# Altium schematic sheet Input.SchDoc
size A2; SheetNumber: 5; SheetTotal: 6
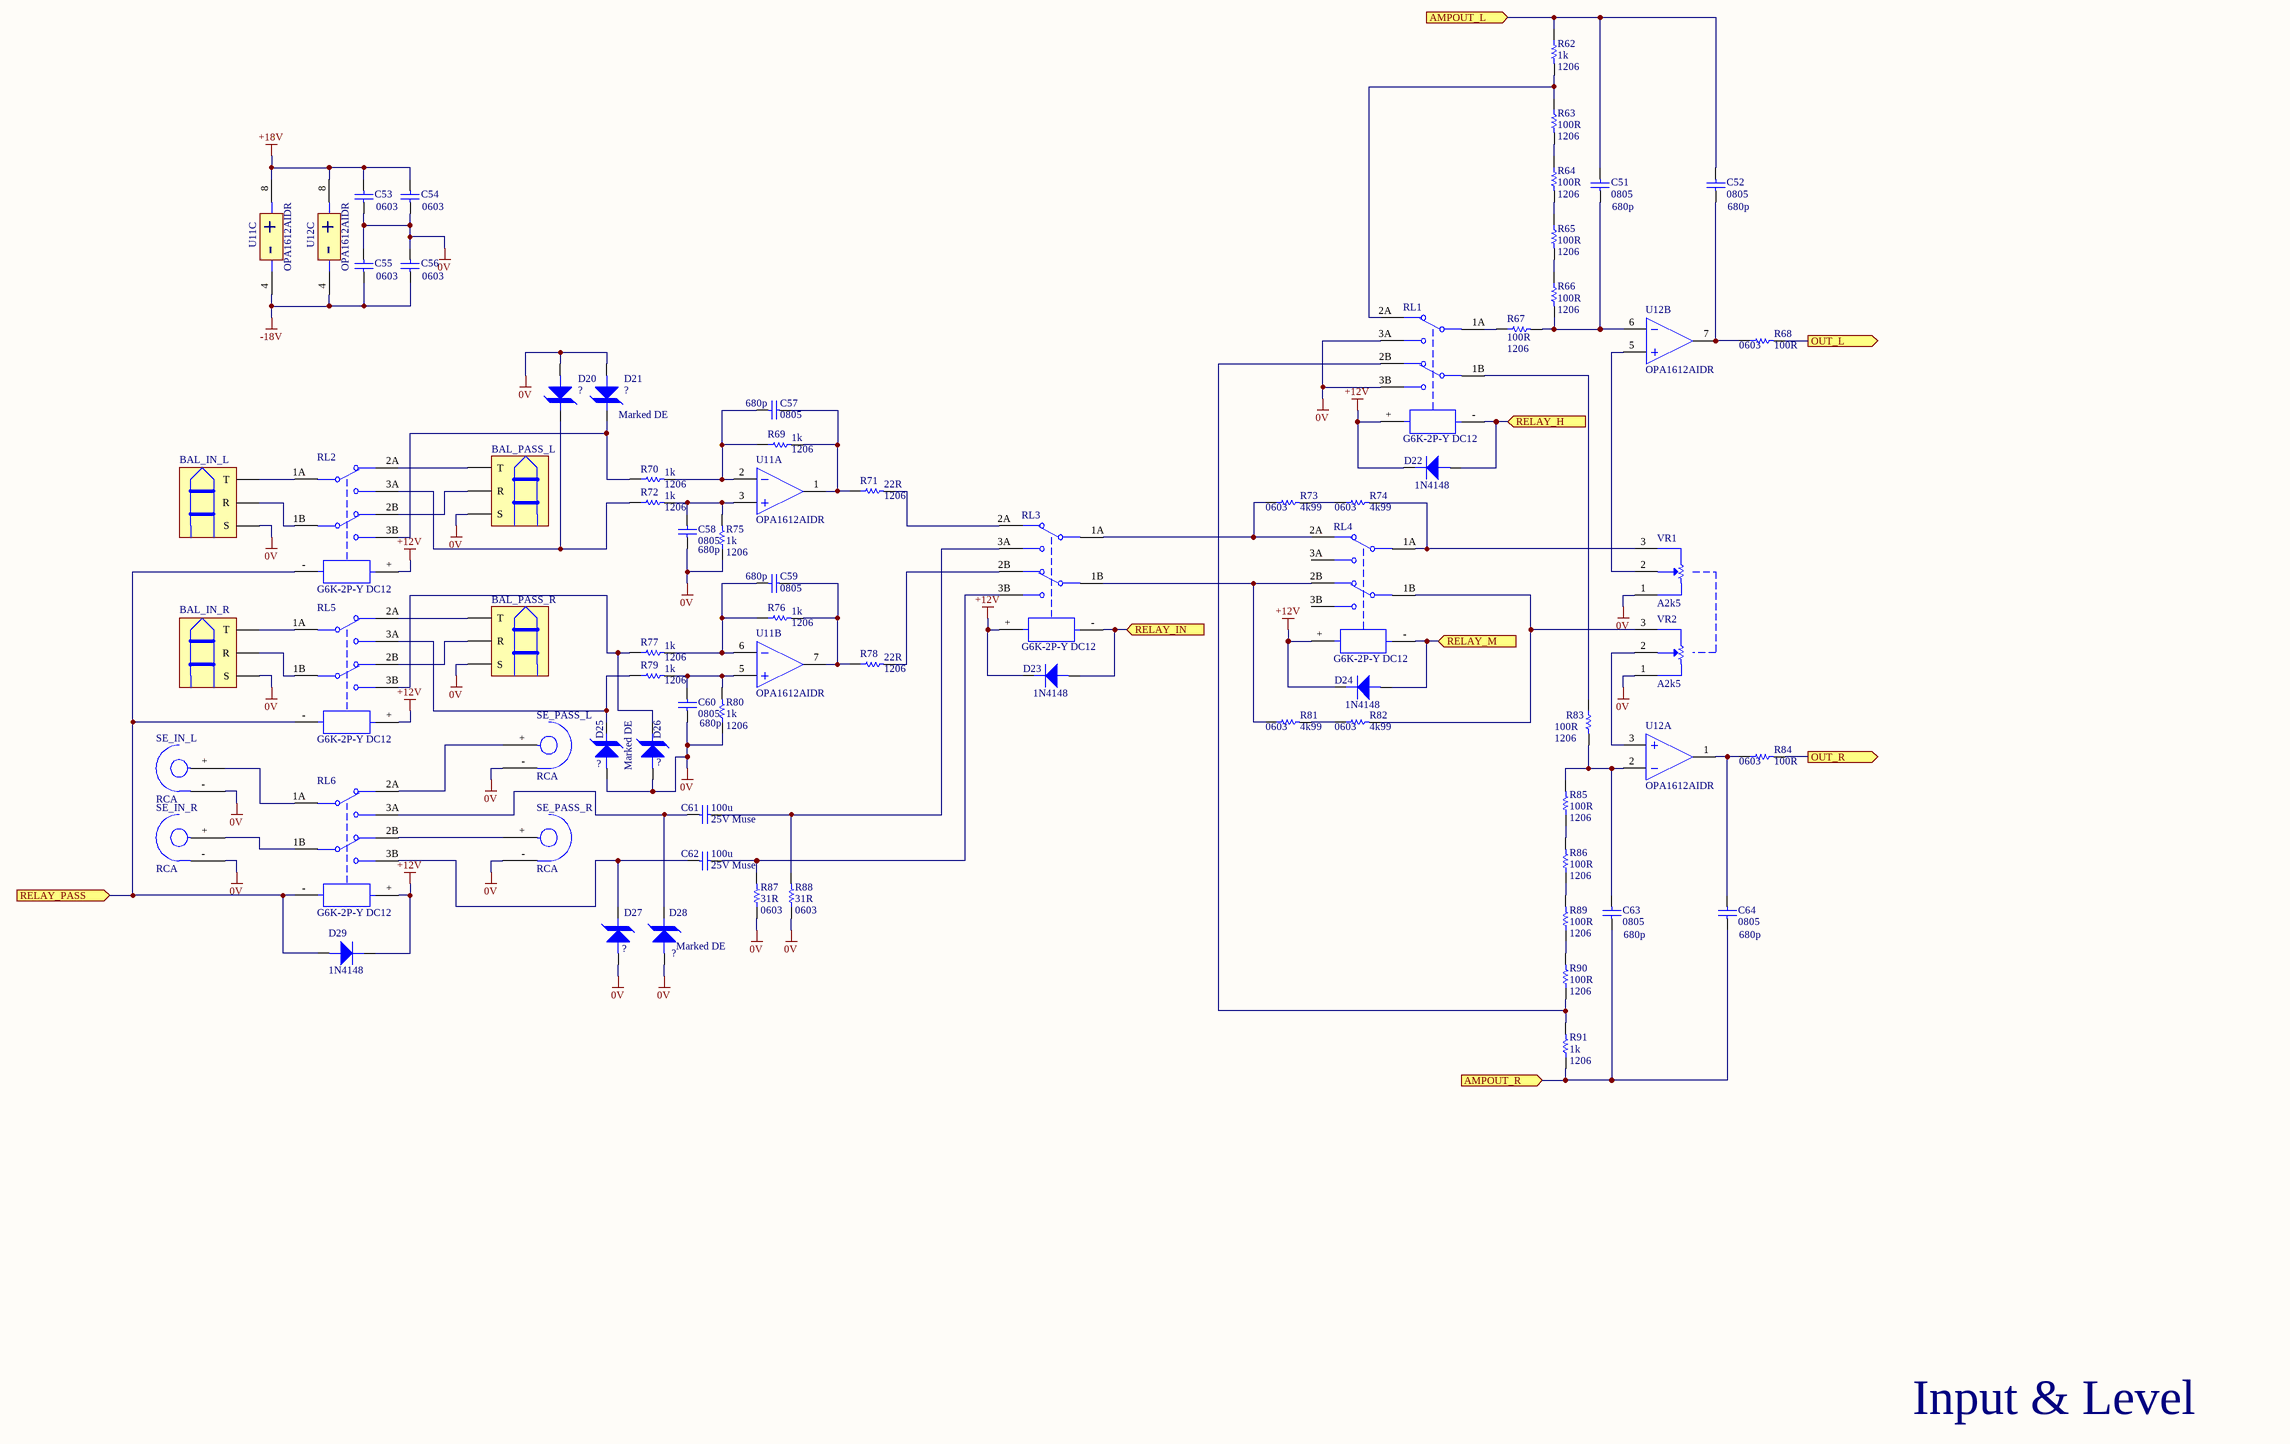
[diagram p0: Input.SchDoc]

## Parts
BAL_IN_L  SJ-63053A  [SJ-63053A]  (value not drawn)
BAL_IN_R  SJ-63053A  [SJ-63053A]  (value not drawn)
BAL_PASS_L  SJ-63053A  [SJ-63053A]  (value not drawn)
BAL_PASS_R  SJ-63053A  [SJ-63053A]  (value not drawn)
C51  value 680p  Package: 0805  [CAPC2012X14N]  (hidden comment: C_MLCC_0805)
C52  value 680p  Package: 0805  [CAPC2012X14N]  (hidden comment: C_MLCC_0805)
C53  Package: 0603  [CAPC1608X09N]  (hidden comment: C_MLCC_0603)
C54  Package: 0603  [CAPC1608X09N]  (hidden comment: C_MLCC_0603)
C55  Package: 0603  [CAPC1608X09N]  (hidden comment: C_MLCC_0603)
C56  Package: 0603  [CAPC1608X09N]  (hidden comment: C_MLCC_0603)
C57  value 680p  Package: 0805  [CAPC2012X14N]  (hidden comment: C_MLCC_0805)
C58  value 680p  Package: 0805  [CAPC2012X14N]  (hidden comment: C_MLCC_0805)
C59  value 680p  Package: 0805  [CAPC2012X14N]  (hidden comment: C_MLCC_0805)
C60  value 680p  Package: 0805  [CAPC2012X14N]  (hidden comment: C_MLCC_0805)
C61  value 100u  Notes: 25V Muse  [CAPC2012X14N]  (hidden comment: C_MLCC_0805)
C62  value 100u  Notes: 25V Muse  [CAPC2012X14N]  (hidden comment: C_MLCC_0805)
C63  value 680p  Package: 0805  [CAPC2012X14N]  (hidden comment: C_MLCC_0805)
C64  value 680p  Package: 0805  [CAPC2012X14N]  (hidden comment: C_MLCC_0805)
D20  TVS  [DIOM4336X24N]  (value not drawn)
D21  TVS  [DIOM4336X24N]  (value not drawn)
D22  1N4148
D23  1N4148
D24  1N4148
D25  TVS  [DIOM4336X24N]  (value not drawn)
D26  TVS  [DIOM4336X24N]  (value not drawn)
D27  TVS  [DIOM4336X24N]  (value not drawn)
D28  TVS  [DIOM4336X24N]  (value not drawn)
D29  1N4148
R62  value 1k  Package: 1206  [RESC3116X06N]  (hidden comment: R)
R63  value 100R  Package: 1206  [RESC3116X06N]  (hidden comment: R)
R64  value 100R  Package: 1206  [RESC3116X06N]  (hidden comment: R)
R65  value 100R  Package: 1206  [RESC3116X06N]  (hidden comment: R)
R66  value 100R  Package: 1206  [RESC3116X06N]  (hidden comment: R)
R67  value 100R  Package: 1206  [RESC3116X06N]  (hidden comment: R)
R68  value 100R  Package: 0603  [RESC1608X06N]  (hidden comment: R)
R69  value 1k  Package: 1206  [RESC3116X06N]  (hidden comment: R)
R70  value 1k  Package: 1206  [RESC3116X06N]  (hidden comment: R)
R71  value 22R  Package: 1206  [RESC3116X06N]  (hidden comment: R)
R72  value 1k  Package: 1206  [RESC3116X06N]  (hidden comment: R)
R73  value 4k99  Package: 0603  [RESC1608X06N]  (hidden comment: R)
R74  value 4k99  Package: 0603  [RESC1608X06N]  (hidden comment: R)
R75  value 1k  Package: 1206  [RESC3116X06N]  (hidden comment: R)
R76  value 1k  Package: 1206  [RESC3116X06N]  (hidden comment: R)
R77  value 1k  Package: 1206  [RESC3116X06N]  (hidden comment: R)
R78  value 22R  Package: 1206  [RESC3116X06N]  (hidden comment: R)
R79  value 1k  Package: 1206  [RESC3116X06N]  (hidden comment: R)
R80  value 1k  Package: 1206  [RESC3116X06N]  (hidden comment: R)
R81  value 4k99  Package: 0603  [RESC1608X06N]  (hidden comment: R)
R82  value 4k99  Package: 0603  [RESC1608X06N]  (hidden comment: R)
R83  value 100R  Package: 1206  [RESC3116X06N]  (hidden comment: R)
R84  value 100R  Package: 0603  [RESC1608X06N]  (hidden comment: R)
R85  value 100R  Package: 1206  [RESC3116X06N]  (hidden comment: R)
R86  value 100R  Package: 1206  [RESC3116X06N]  (hidden comment: R)
R87  value 31R  Package: 0603  [RESC1608X06N]  (hidden comment: R)
R88  value 31R  Package: 0603  [RESC1608X06N]  (hidden comment: R)
R89  value 100R  Package: 1206  [RESC3116X06N]  (hidden comment: R)
R90  value 100R  Package: 1206  [RESC3116X06N]  (hidden comment: R)
R91  value 1k  Package: 1206  [RESC3116X06N]  (hidden comment: R)
RL1  G6K-2P-Y DC12  [G6K-2P-Y]
RL2  G6K-2P-Y DC12  [G6K-2P-Y]
RL3  G6K-2P-Y DC12  [G6K-2P-Y]
RL4  G6K-2P-Y DC12  [G6K-2P-Y]
RL5  G6K-2P-Y DC12  [G6K-2P-Y]
RL6  G6K-2P-Y DC12  [G6K-2P-Y]
SE_IN_L  RCA
SE_IN_R  RCA
SE_PASS_L  RCA
SE_PASS_R  RCA
U11  OPA1612AIDR  [SOIC127P600X175-8L]  (parts A,B,C of 3)
U12  OPA1612AIDR  [SOIC127P600X175-8L]  (parts A,B,C of 3)
VR1  value A2k5  (hidden comment: Pot)
VR2  value A2k5  (hidden comment: Pot)

## Ports
AMPOUT_L (in, see Top[2C]), AMPOUT_R (in, see Top[2C]), OUT_L (out, see Top[2B]), OUT_R (out, see Top[2B]), RELAY_H (in, see Top[2C], STM[7C]), RELAY_IN (in, see Top[2C], STM[8D]), RELAY_M (in, see Top[2C], STM[7C]), RELAY_PASS (in, see Top[2C], STM[8C])

## Nets
0V: BAL_IN_L.S BAL_IN_R.S BAL_PASS_L.S BAL_PASS_R.S C53.1 C54.1 C55.2 C56.2 C58.1 C60.1 D20.A D21.A D25.A D26.A D27.A D28.A R75.1 R80.1 R87.1 R88.1 RL1.3A RL1.3B SE_IN_L.- SE_IN_R.- SE_PASS_L.- SE_PASS_R.- VR1.1 VR2.1
+12V: D22.K D23.K D24.K D29.K RL1.+ RL2.+ RL3.+ RL4.+ RL5.+ RL6.+
+18V: C53.2 C54.2 U11.8(VCC+) U12.8(VCC+)
-18V: C55.1 C56.1 U11.4(VCC-) U12.4(VCC-)
AMPOUT_L: C51.2 C52.2 R62.1 ; port AMPOUT_L
AMPOUT_R: C63.1 C64.1 R91.1 ; port AMPOUT_R
OUT_L: R68.2 ; port OUT_L
OUT_R: R84.2 ; port OUT_R
RELAY_H: D22.A RL1.- ; port RELAY_H
RELAY_IN: D23.A RL3.- ; port RELAY_IN
RELAY_M: D24.A RL4.- ; port RELAY_M
RELAY_PASS: D29.A RL2.- RL5.- RL6.- ; port RELAY_PASS
NetBAL_IN_L_R: BAL_IN_L.R RL2.1B
NetBAL_IN_L_T: BAL_IN_L.T RL2.1A
NetBAL_IN_R_R: BAL_IN_R.R RL5.1B
NetBAL_IN_R_T: BAL_IN_R.T RL5.1A
NetBAL_PASS_L_R: BAL_PASS_L.R RL2.2B
NetBAL_PASS_L_T: BAL_PASS_L.T RL2.2A
NetBAL_PASS_R_R: BAL_PASS_R.R RL5.2B
NetBAL_PASS_R_T: BAL_PASS_R.T RL5.2A
NetC51_1: C51.1 R66.2 R67.2 U12.6(IN2-)
NetC52_1: C52.1 R68.1 U12.7(OUT2)
NetC57_1: C57.1 R69.1 R70.2 U11.2(IN1-)
NetC57_2: C57.2 R69.2 R71.1 U11.1(OUT1)
NetC58_2: C58.2 R72.2 R75.2 U11.3(IN1+)
NetC59_1: C59.1 R76.1 R77.2 U11.6(IN2-)
NetC59_2: C59.2 R76.2 R78.1 U11.7(OUT2)
NetC60_2: C60.2 R79.2 R80.2 U11.5(IN2+)
NetC61_1: C61.1 D28.K RL6.3A
NetC61_2: C61.2 R88.2 RL3.3A
NetC62_1: C62.1 D27.K RL6.3B
NetC62_2: C62.2 R87.2 RL3.3B
NetC63_2: C63.2 R83.2 R85.2 U12.2(IN1-)
NetC64_2: C64.2 R84.1 U12.1(OUT1)
NetD20_K: D20.K R72.1 RL2.3A
NetD21_K: D21.K R70.1 RL2.3B
NetD25_K: D25.K R79.1 RL5.3A
NetD26_K: D26.K R77.1 RL5.3B
NetR62_2: R62.2 R63.1 RL1.2A
NetR63_2: R63.2 R64.1
NetR64_2: R64.2 R65.1
NetR65_2: R65.2 R66.1
NetR67_1: R67.1 RL1.1A
NetR71_2: R71.2 RL3.2A
NetR73_1: R73.1 RL3.1A RL4.2A
NetR73_2: R73.2 R74.1
NetR74_2: R74.2 RL4.1A VR1.3
NetR78_2: R78.2 RL3.2B
NetR81_1: R81.1 RL3.1B RL4.2B
NetR81_2: R81.2 R82.1
NetR82_2: R82.2 RL4.1B VR2.3
NetR83_1: R83.1 RL1.1B
NetR85_1: R85.1 R86.2
NetR86_1: R86.1 R89.2
NetR89_1: R89.1 R90.2
NetR90_1: R90.1 R91.2 RL1.2B
NetRL6_1A: RL6.1A SE_IN_L.+
NetRL6_1B: RL6.1B SE_IN_R.+
NetRL6_2A: RL6.2A SE_PASS_L.+
NetRL6_2B: RL6.2B SE_PASS_R.+
NetU12_3: U12.3(IN1+) VR2.2
NetU12_5: U12.5(IN2+) VR1.2

Not connected (* = marked no-connect by the designer): RL4 3A 3B

## Notes on the sheet
- (near D21) Marked DE
- Marked DE
- (near D28) Marked DE
- Input & Level
- (in symbol OPA1612AIDR, part C) +; -

## Library data of the parts
BAL_IN_L BAL_IN_R BAL_PASS_L BAL_PASS_R = SJ-63053A: 6.35 mm, Stereo, Right Angle, Through Hole Mount, 3 Conductors, 0 Internal Switches, Audio Jack Connector; Manufacturer: Same Sky; Category: Connector; Sub-Category: Jack; Value: SJ-63053A
C51 C52 C57-C64 = C_MLCC_0805: Generic MLCC 0805 Non Polarized Capacitor; Category: Capacitor; Sub-Category: MLCC; Manufacturer: Generic
  C51 C52 C57-C60 C63 C64: Notes: *
  C61 C62: Package: 0805
C53-C56 = C_MLCC_0603: Generic MLCC 0603 Non Polarized Capacitor; Category: Capacitor; Sub-Category: MLCC; Manufacturer: Generic; Notes: *; Value: *
D20 D21 D25-D28 = TVS: Generic TVS diode; Manufacturer: Bourns; Manufacturer Part Number: SMBJ30A; Breakdown Voltage-Nom: 35.8V; JEDEC-95 Code: DO-214AA; Diode Element Material: SILICON; Min Breakdown Voltage: 33.3V; Max Power Dissipation: 5W; Rep Pk Reverse Voltage-Max: 30V; Number of Elements: 1; Reference Standard: IEC-61000-4-2; Diode Type: TRANS VOLTAGE SUPPRESSOR; Max Breakdown Voltage: 36.8V; Non-rep Peak Rev Power Dis-Max: 600W; Package Body Material: Plastic; Polarity: Unidirectional; Qualification Status: Not Qualified; Min Operating Temperature: -55°C; REACH SVHC: No SVHC; Terminal Finish: Tin; Moisture Sensitivity Level: 1; Number of Pins: 2; JESD-30 Code: R-PDSO-C2; Technology: AVALANCHE; Terminal Position: DUAL; Max Operating Temperature: 150°C; Package Style: SMALL OUTLINEMeter; Package Shape: Rectangular; Terminal Form: C BEND; RoHS Compliant: Yes; Surface Mount: Yes; JESD-609 Code: e3; Sub-Category: TVS; Category: Diode; Component Type: Standard_Diode; Value: ?
D22-D24 D29 = 1N4148: Generic small signal diode; Manufacturer Part Number: BAT48ZFILM; Number of Elements: 1; Rep Pk Reverse Voltage-Max: 40V; Package Body Material: Plastic; Diode Type: RECTIFIER; Forward Voltage-Max (VF): 250mV; Non-rep Pk Forward Current-Max: 2A; Diode Element Material: SILICON; Time @ Peak Reflow Temperature-Max (s): 30s; Max Output Current: 350mA; Qualification Status: Not Qualified; Peak Reflow Temperature (Cel): 260°C; Max Operating Temperature: 150°C; Terminal Position: DUAL; Technology: SCHOTTKY; JESD-30 Code: R-PDSO-G2; Category: Diode; Surface Mount: Yes; RoHS Compliant: Yes; Manufacturer: Generic; Number of Pins: 2; Sub-Category: Signal; Terminal Form: Gull Wing; REACH SVHC: Yes; JESD-609 Code: e3; Package Shape: Rectangular; Package Style: SMALL OUTLINEMeter; Terminal Finish: Tin; Component Type: Standard_Diode; Value: 1N4148
R62-R67 R69-R72 R75-R80 R83 R85 R86 R89-R91 = R_1206: Generic 1206 Single Resistor; Manufacturer: Generic; Category: Resistor; Sub-Category: SMD; Notes: *
R68 R73 R74 R81 R82 R84 R87 R88 = R_0603: Generic 0603 Single Resistor; Manufacturer: Generic; Category: Resistor; Sub-Category: SMD; Notes: *
RL1-RL6 = G6K-2P-Y DC12: Low Signal Relays - PCB Gullwing NoLatch 3.2 DPDT 12VDC 100mW T/R; Manufacturer: Omron; Category: Switch; Sub-Category: Relay; Value: G6K-2P-Y DC12
SE_IN_L SE_IN_R SE_PASS_L SE_PASS_R = RCA: Generic RCA Connector; Manufacturer: Generic; Category: Connector; Sub-Category: Audio; Value: RCA
U11 U12 = OPA1612AIDR: High-Performance, Bipolar-Input Audio Operational Amplifiers; Manufacturer: Texas Instruments; Category: IC; Sub-Category: OpAmp; Package: SOIC8; Value: OPA1612AIDR
VR1 VR2 = Pot: Generic Pot; Manufacturer: Generic; Category: Resistor; Sub-Category: Pot